# EAGLE design Binary_Sequencer_board2_controls (EAGLE 9.1.2)
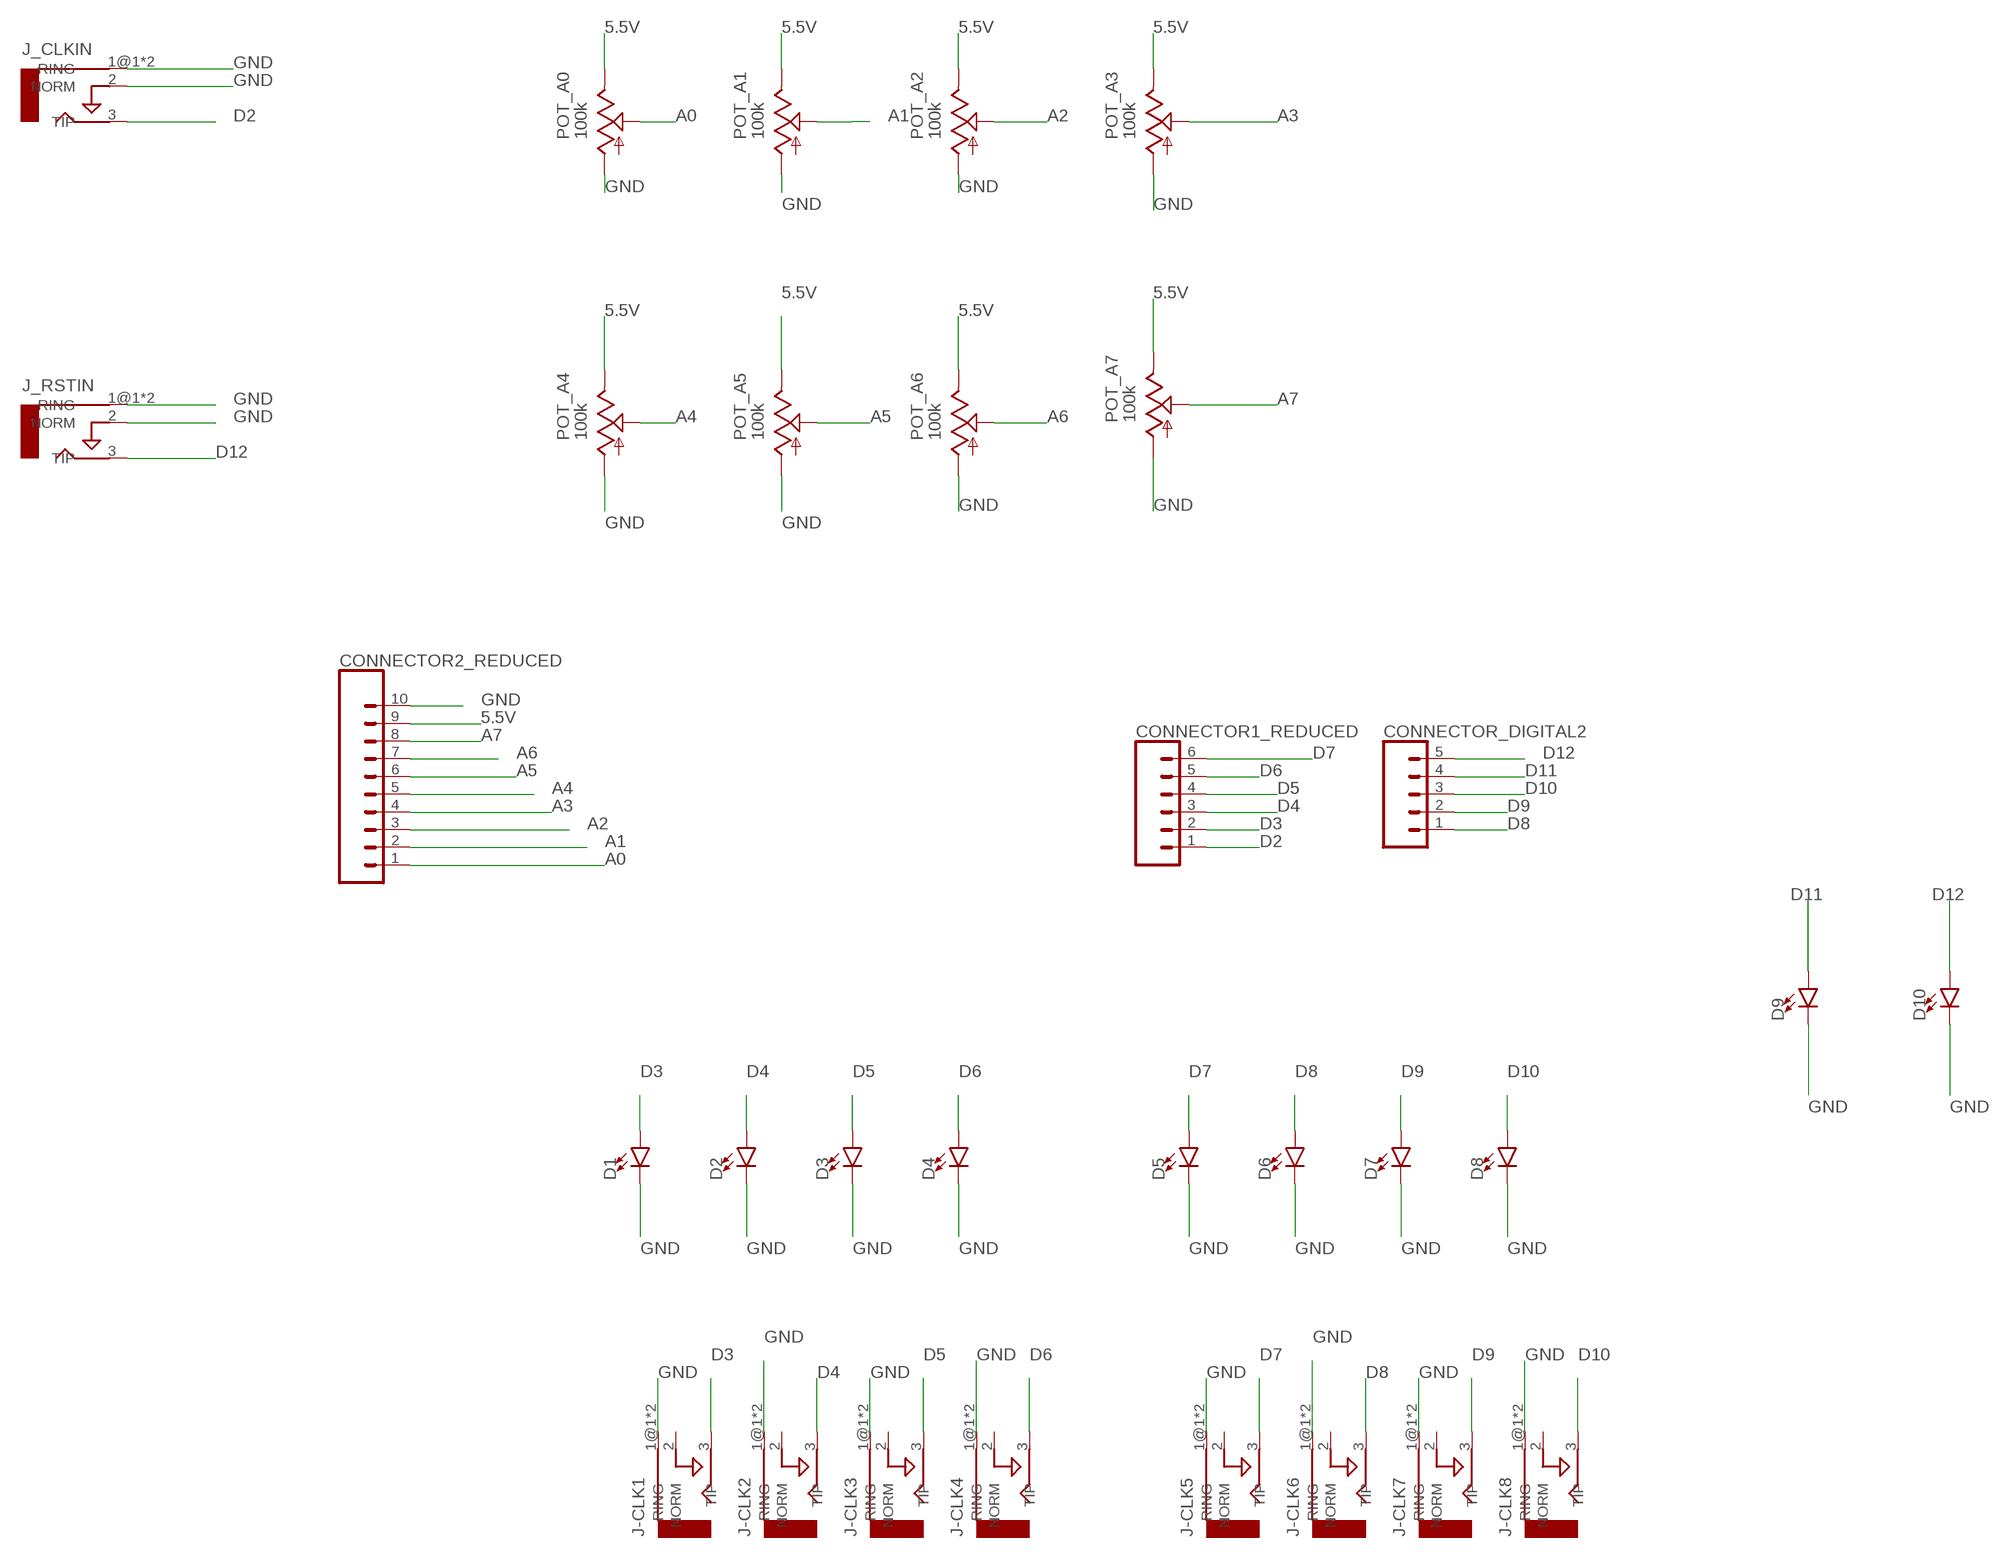
[diagram p0: schematic, sheet 1]

## Parts
CONNECTOR1_REDUCED  CONN_06LONGPADS  [1X06_LONGPADS]
CONNECTOR2_REDUCED  CONN_10_LONGPADS10_LONGPADS  [1X10_LONGPADS]
CONNECTOR_DIGITAL2  CONN_05PTH_LONGPADS  [1X05_LONGPADS]
D1  LED-3MM-NO_SILK  [LED_3MM-NS]
D2  LED-3MM-NO_SILK  [LED_3MM-NS]
D3  LED-3MM-NO_SILK  [LED_3MM-NS]
D4  LED-3MM-NO_SILK  [LED_3MM-NS]
D5  LED-3MM-NO_SILK  [LED_3MM-NS]
D6  LED-3MM-NO_SILK  [LED_3MM-NS]
D7  LED-3MM-NO_SILK  [LED_3MM-NS]
D8  LED-3MM-NO_SILK  [LED_3MM-NS]
D9  LED-3MM-NO_SILK  [LED_3MM-NS]
D10  LED-3MM-NO_SILK  [LED_3MM-NS]
J-CLK1  AUDIO-JACKERTHENVAR  [ERTHENVAR-JACK]
J-CLK2  AUDIO-JACKERTHENVAR  [ERTHENVAR-JACK]
J-CLK3  AUDIO-JACKERTHENVAR  [ERTHENVAR-JACK]
J-CLK4  AUDIO-JACKERTHENVAR  [ERTHENVAR-JACK]
J-CLK5  AUDIO-JACKERTHENVAR  [ERTHENVAR-JACK]
J-CLK6  AUDIO-JACKERTHENVAR  [ERTHENVAR-JACK]
J-CLK7  AUDIO-JACKERTHENVAR  [ERTHENVAR-JACK]
J-CLK8  AUDIO-JACKERTHENVAR  [ERTHENVAR-JACK]
J_CLKIN  AUDIO-JACKERTHENVAR  [ERTHENVAR-JACK]
J_RSTIN  AUDIO-JACKERTHENVAR  [ERTHENVAR-JACK]
POT_A0  100k  9MM_SNAP-IN_POT_  [9MM_SNAP-IN_POT]
POT_A1  100k  9MM_SNAP-IN_POT_  [9MM_SNAP-IN_POT]
POT_A2  100k  9MM_SNAP-IN_POT_  [9MM_SNAP-IN_POT]
POT_A3  100k  9MM_SNAP-IN_POT_  [9MM_SNAP-IN_POT]
POT_A4  100k  9MM_SNAP-IN_POT_  [9MM_SNAP-IN_POT]
POT_A5  100k  9MM_SNAP-IN_POT_  [9MM_SNAP-IN_POT]
POT_A6  100k  9MM_SNAP-IN_POT_  [9MM_SNAP-IN_POT]
POT_A7  100k  9MM_SNAP-IN_POT_  [9MM_SNAP-IN_POT]

## Nets
5.5V: CONNECTOR2_REDUCED.9 POT_A0.3(E) POT_A1.3(E) POT_A2.3(E) POT_A3.3(E) POT_A4.3(E) POT_A5.3(E) POT_A6.3(E) POT_A7.3(E)
A0: CONNECTOR2_REDUCED.1 POT_A0.2(S)
A1: CONNECTOR2_REDUCED.2 POT_A1.2(S)
A2: CONNECTOR2_REDUCED.3 POT_A2.2(S)
A3: CONNECTOR2_REDUCED.4 POT_A3.2(S)
A4: CONNECTOR2_REDUCED.5 POT_A4.2(S)
A5: CONNECTOR2_REDUCED.6 POT_A5.2(S)
A6: CONNECTOR2_REDUCED.7 POT_A6.2(S)
A7: CONNECTOR2_REDUCED.8 POT_A7.2(S)
D2: CONNECTOR1_REDUCED.1 J_CLKIN.3(TIP)
D3: CONNECTOR1_REDUCED.2 D1.A J-CLK1.3(TIP)
D4: CONNECTOR1_REDUCED.3 D2.A J-CLK2.3(TIP)
D5: CONNECTOR1_REDUCED.4 D3.A J-CLK3.3(TIP)
D6: CONNECTOR1_REDUCED.5 D4.A J-CLK4.3(TIP)
D7: CONNECTOR1_REDUCED.6 D5.A J-CLK5.3(TIP)
D8: CONNECTOR_DIGITAL2.1 D6.A J-CLK6.3(TIP)
D9: CONNECTOR_DIGITAL2.2 D7.A J-CLK7.3(TIP)
D10: CONNECTOR_DIGITAL2.3 D8.A J-CLK8.3(TIP)
D11: CONNECTOR_DIGITAL2.4 D9.A
D12: CONNECTOR_DIGITAL2.5 D10.A J_RSTIN.3(TIP)
GND: CONNECTOR2_REDUCED.10 D1.K(C) D2.K(C) D3.K(C) D4.K(C) D5.K(C) D6.K(C) D7.K(C) D8.K(C) D9.K(C) D10.K(C) J-CLK1.1@1(RING) J-CLK1.1@2(RING) J-CLK2.1@1(RING) J-CLK2.1@2(RING) J-CLK3.1@1(RING) J-CLK3.1@2(RING) J-CLK4.1@1(RING) J-CLK4.1@2(RING) J-CLK5.1@1(RING) J-CLK5.1@2(RING) J-CLK6.1@1(RING) J-CLK6.1@2(RING) J-CLK7.1@1(RING) J-CLK7.1@2(RING) J-CLK8.1@1(RING) J-CLK8.1@2(RING) J_CLKIN.1@1(RING) J_CLKIN.1@2(RING) J_CLKIN.2(NORM) J_RSTIN.1@1(RING) J_RSTIN.1@2(RING) J_RSTIN.2(NORM) POT_A0.1(A) POT_A1.1(A) POT_A2.1(A) POT_A3.1(A) POT_A4.1(A) POT_A5.1(A) POT_A6.1(A) POT_A7.1(A)
Unconnected: J-CLK1.2(NORM) J-CLK2.2(NORM) J-CLK3.2(NORM) J-CLK4.2(NORM) J-CLK5.2(NORM) J-CLK6.2(NORM) J-CLK7.2(NORM) J-CLK8.2(NORM)

## Library data of the parts
CONNECTOR1_REDUCED = SparkFun-Connectors:CONN_06: Multi connection point. Often used as Generic Header-pin footprint for 0.1 inch spaced/style header connections On any of the 0.1 inch spaced packages, you can populate with these: Break Away Headers - Straight <https://www.sparkfun.com/products/116> (PRT-00116) Break Away Male Headers - Right Angle <https://www.sparkfun.com/products/553> (PRT-00553) Female Headers <https://www.sparkfun.com/products/115> (PRT-00115) Break Away Headers - Machine Pin <https://www.sparkfun.com/products/117> (PRT-00117) Break Away Female Headers - Swiss Machine Pin <https://www.sparkfun.com/products/743> (PRT-00743) Arduino Stackable Header - 6 Pin <https://www.sparkfun.com/products/9280> (PRT-09280) For SCREWTERMINALS and SPRING TERMINALS visit here: Screw Terimnals on SparkFun.com <https://www.sparkfun.com/search/results?term=Screw+Terminals> (5mm/3.5mm/2.54mm spacing) This device is also useful as a general connection point to wire up your design to another part of your project. Our various solder wires solder well into these plated through hole pads. Hook-Up Wire - Assortment (Stranded, 22 AWG) <https://www.sparkfun.com/products/11375> (PRT-11375) Hook-Up Wire - Assortment (Solid Core, 22 AWG) <https://www.sparkfun.com/products/11367> (PRT-11367) View the entire wire category on our website here <https://www.sparkfun.com/categories/141>
CONNECTOR2_REDUCED = 10_Long_Pads:CONN_10_LONGPADS: Multi connection point. Often used as Generic Header-pin footprint for 0.1 inch spaced/style header connections On any of the 0.1 inch spaced packages, you can populate with these: Break Away Headers - Straight <https://www.sparkfun.com/products/116> (PRT-00116) Break Away Male Headers - Right Angle <https://www.sparkfun.com/products/553> (PRT-00553) Female Headers <https://www.sparkfun.com/products/115> (PRT-00115) Break Away Headers - Machine Pin <https://www.sparkfun.com/products/117> (PRT-00117) Break Away Female Headers - Swiss Machine Pin <https://www.sparkfun.com/products/743> (PRT-00743) For SCREWTERMINALS and SPRING TERMINALS visit here: Screw Terimnals on SparkFun.com <https://www.sparkfun.com/search/results?term=Screw+Terminals> (5mm/3.5mm/2.54mm spacing) This device is also useful as a general connection point to wire up your design to another part of your project. Our various solder wires solder well into these plated through hole pads. Hook-Up Wire - Assortment (Stranded, 22 AWG) <https://www.sparkfun.com/products/11375> (PRT-11375) Hook-Up Wire - Assortment (Solid Core, 22 AWG) <https://www.sparkfun.com/products/11367> (PRT-11367) View the entire wire category on our website here <https://www.sparkfun.com/categories/141>
CONNECTOR_DIGITAL2 = SparkFun-Connectors:CONN_05: Multi connection point. Often used as Generic Header-pin footprint for 0.1 inch spaced/style header connections On any of the 0.1 inch spaced packages, you can populate with these: Break Away Headers - Straight <https://www.sparkfun.com/products/116> (PRT-00116) Break Away Male Headers - Right Angle <https://www.sparkfun.com/products/553> (PRT-00553) Female Headers <https://www.sparkfun.com/products/115> (PRT-00115) Break Away Headers - Machine Pin <https://www.sparkfun.com/products/117> (PRT-00117) Break Away Female Headers - Swiss Machine Pin <https://www.sparkfun.com/products/743> (PRT-00743) For SCREWTERMINALS and SPRING TERMINALS visit here: Screw Terimnals on SparkFun.com <https://www.sparkfun.com/search/results?term=Screw+Terminals> (5mm/3.5mm/2.54mm spacing) This device is also useful as a general connection point to wire up your design to another part of your project. Our various solder wires solder well into these plated through hole pads. Hook-Up Wire - Assortment (Stranded, 22 AWG) <https://www.sparkfun.com/products/11375> (PRT-11375) Hook-Up Wire - Assortment (Solid Core, 22 AWG) <https://www.sparkfun.com/products/11367> (PRT-11367) View the entire wire category on our website here <https://www.sparkfun.com/categories/141> Special notes: Molex polarized connector foot print use with SKU : PRT-08231 with associated crimp pins and housings. 1MM SMD Version SKU: PRT-10208
D1-D10 = SparkFun-LED:LED: LED (Generic) Standard schematic elements and footprints for 5mm, 3mm, 1206, and 0603 sized LEDs. Generic LEDs with no color specified.
J-CLK1-J-CLK8 J_CLKIN J_RSTIN = erthenvar:AUDIO-JACK: Switching Mono 3.5mm Audio Jack from Erthenvar.
POT_A0 POT_A1-POT_A7 = MusicThingModular:9MM_SNAP-IN_POT: 9mm vertical snap-in pot, Alpha / Panasonic style

## Board
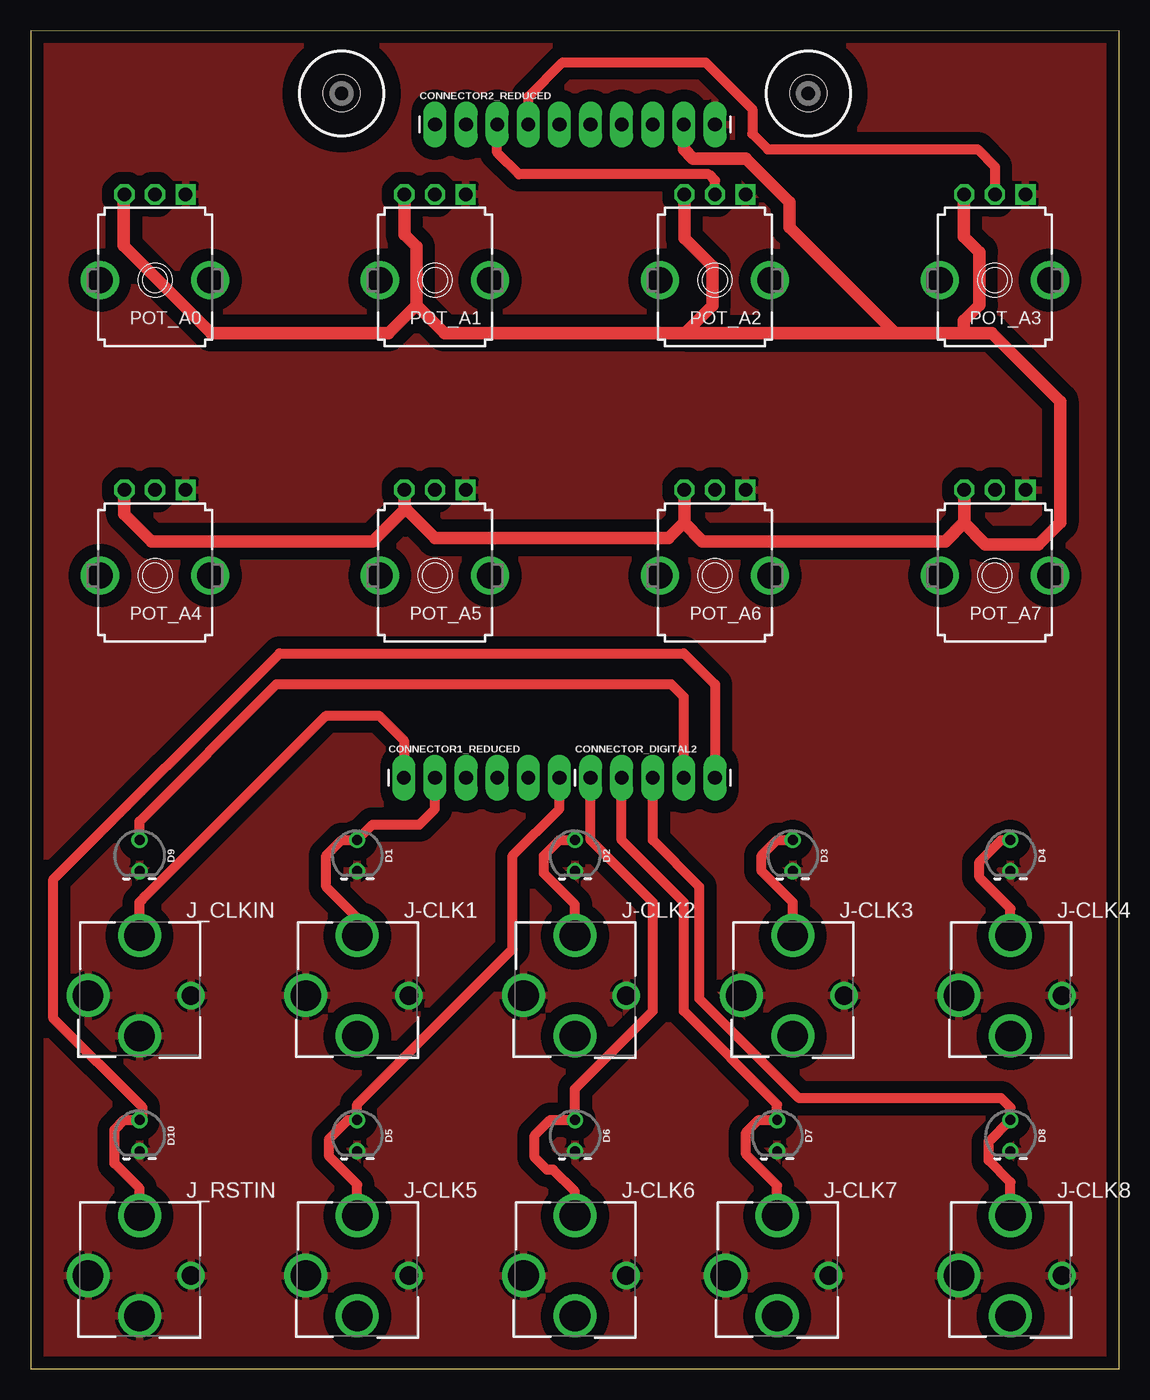
[diagram p1: board, top side]
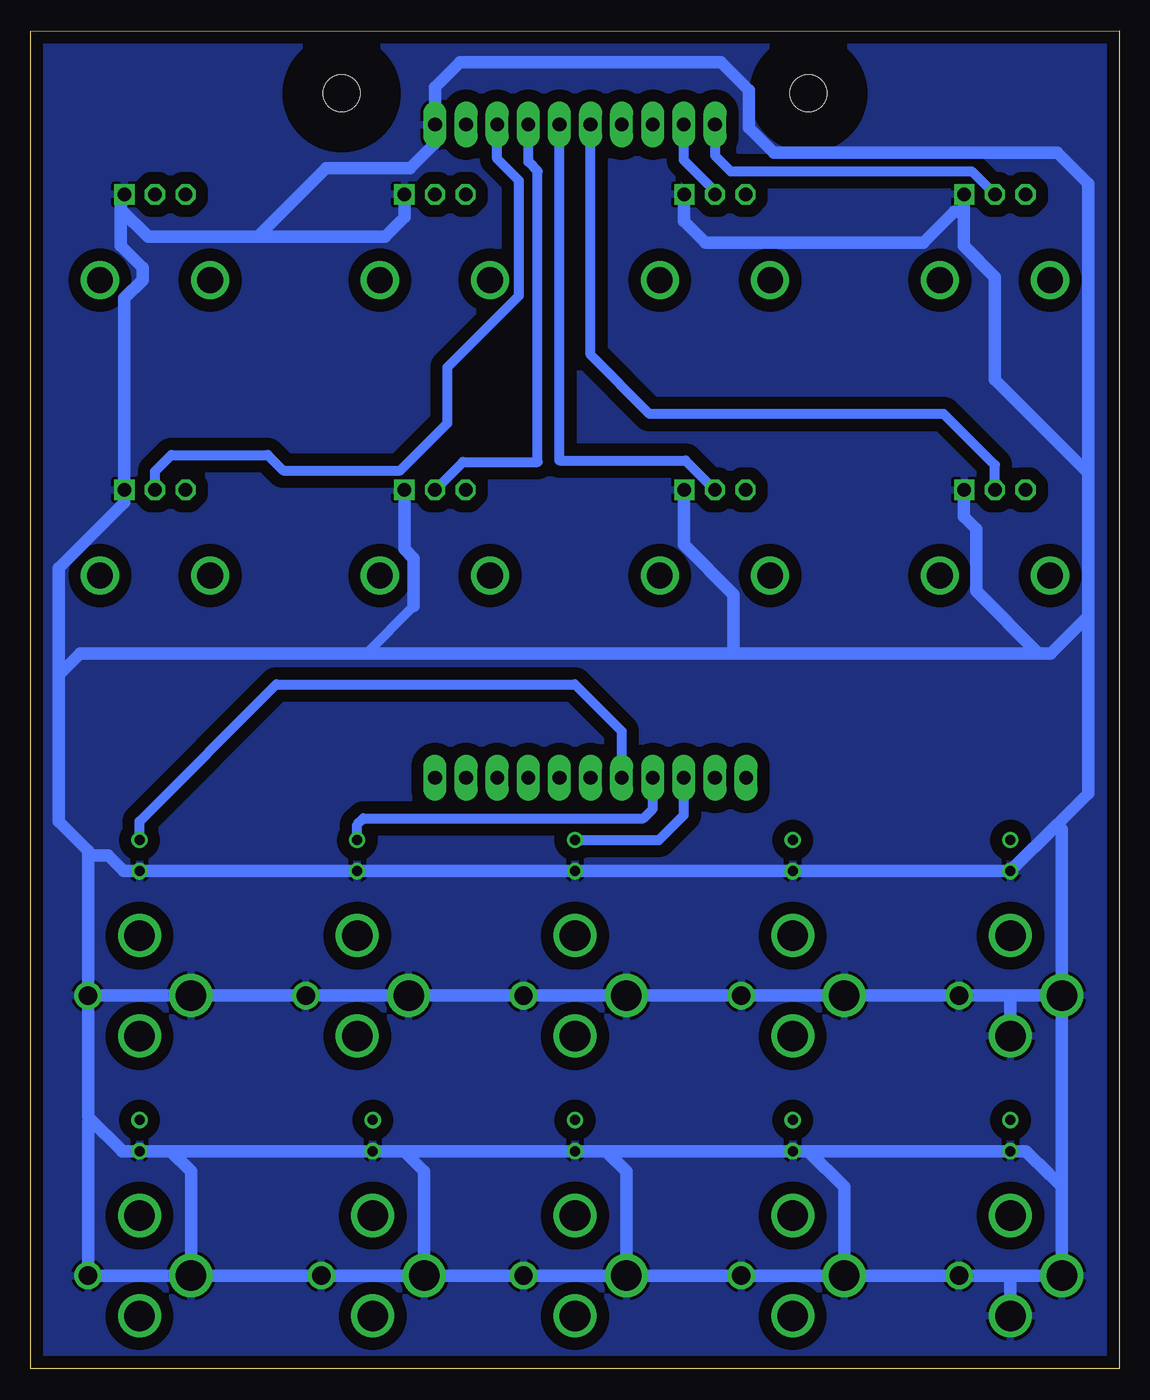
[diagram p2: board, bottom side, seen from below]

Size 88.9 x 109.27 mm. Coordinates in mm from the lower left corner, seen from the top.
Outline: 0,0 88.9,0 88.9,109.22 0,109.27 0,0
Copper layers (1*16): Top 0.035mm / dielectric 1.5mm / Bottom 0.035mm
Design rules "default": minimum track width 6mil, minimum drill 0.35mm, track to track 6mil, track to pad 6mil, pad to pad 6mil, via to via 6mil, smd to smd 6mil, copper to edge 40mil, drill to drill 6mil, minimum pad ring 10mil, minimum via ring 8mil, stop-mask expansion 4mil, vias tented up to drill 0mil, thermal gap 10mil

### Footprints (pad centres in the part's own frame; a part is rotated, then mirrored left to right if it is on the bottom)
1X06_LONGPADS = drill 1.118 pad 1.88 long: 1 0,0; 2 2.54,0; 3 5.08,0; 4 7.62,0; 5 10.16,0; 6 12.7,0
1X10_LONGPADS = drill 1.118 pad 1.88 long: 1 0,0; 2 2.54,0; 3 5.08,0; 4 7.62,0; 5 10.16,0; 6 12.7,0; 7 15.24,0; 8 17.78,0; 9 20.32,0; 10 22.86,0
1X05_LONGPADS = drill 1.118 pad 1.88 long: 1 0,0; 2 2.54,0; 3 5.08,0; 4 7.62,0; 5 10.16,0
LED_3MM-NS = drill 0.813: A -1.27,0; K 1.27,0
DRIL-3 = hole 3: 0,0
ERTHENVAR-JACK = drill 2.5: 1@1 -4.2,0; 2 0,-3.3; 3 0,4.9 | drill 1.5: 1@2 4.2,0
9MM_SNAP-IN_POT = drill 1.1 square: 1 -2.5,-7 | drill 1.1 octagon: 2 0,-7; 3 2.5,-7 | drill 2.1 pad 2.794: CHASSIS1 -4.5,0; CHASSIS2 4.5,0

### Placement (x,y rotation side)
CONNECTOR1_REDUCED  30.48,48.26 0 top
CONNECTOR2_REDUCED  33.02,101.6 0 top
CONNECTOR_DIGITAL2  45.72,48.26 0 top
D1  26.67,41.91 270 top
D2  44.45,41.91 270 top
D3  62.23,41.91 270 top
D4  80.01,41.91 270 top
D5  26.67,19.05 270 top
D6  44.45,19.05 270 top
D7  60.96,19.05 270 top
D8  80.01,19.05 270 top
D9  8.89,41.91 270 top
D10  8.89,19.05 270 top
H1  [DRIL-3]  25.4,104.14 0 top
H2  [DRIL-3]  63.5,104.14 0 top
J-CLK1  26.67,30.48 0 top
J-CLK2  44.45,30.48 0 top
J-CLK3  62.23,30.48 0 top
J-CLK4  80.01,30.48 0 top
J-CLK5  26.67,7.62 0 top
J-CLK6  44.45,7.62 0 top
J-CLK7  60.96,7.62 0 top
J-CLK8  80.01,7.62 0 top
J_CLKIN  8.89,30.48 0 top
J_RSTIN  8.89,7.62 0 top
POT_A0  10.16,88.9 180 top
POT_A1  33.02,88.9 180 top
POT_A2  55.88,88.9 180 top
POT_A3  78.74,88.9 180 top
POT_A4  10.16,64.77 180 top
POT_A5  33.02,64.77 180 top
POT_A6  55.88,64.77 180 top
POT_A7  78.74,64.77 180 top

### Tracks (layer width: path | path; a pad name or v marks a point on that pad's centre or on a via)
5.5V
  Top 1.016: 31.5,86.87 31.5,91.62 30.52,92.6 POT_A1.3 | 53.42,84.58 70.61,84.58 | 70.61,84.58 76.2,84.58 | 76.2,84.58 78.49,84.58 84.07,78.99 84.07,69.09 82.3,67.31 77.98,67.31 76.2,69.09 | 53.42,84.58 55.67,86.83 55.67,90.06 53.38,92.34 POT_A2.3 | POT_A0.3 7.62,95.86 7.62,91.69 14.73,84.58 29.21,84.58 31.5,86.87 | 30.52,70.14 POT_A5.3 | 30.52,70.14 27.94,67.56 9.91,67.56 7.66,69.81 POT_A4.3 | 76.2,69.09 76.24,69.13 POT_A7.3 | 76.2,69.09 74.68,67.56 54.86,67.56 53.34,69.09 | 53.34,69.09 53.38,69.13 POT_A6.3 | 53.34,69.09 52.07,67.82 33.02,67.82 30.69,70.14 30.52,70.14 | 31.5,86.87 33.78,84.58 53.42,84.58 | 76.2,84.58 76.2,85.6 77.47,86.87 77.47,91.19 76.2,92.46 76.2,95.86 POT_A3.3 | 70.61,84.58 61.98,93.22 61.98,95.25 58.42,98.81 54.1,98.81 53.34,99.57 CONNECTOR2_REDUCED.9
A0
  Bottom 0.813: POT_A0.2 12.05,97.79 31.75,97.79 33.02,99.06 CONNECTOR2_REDUCED.1
A1
  Bottom 0.813: CONNECTOR2_REDUCED.2 35.56,98.69 33.02,96.15 POT_A1.2
A2
  Top 0.813: POT_A2.2 55.88,97.03 55.37,97.54 39.88,97.54 38.1,99.31 CONNECTOR2_REDUCED.3
A3
  Top 0.813: POT_A3.2 78.74,98.16 77.33,99.57 60.2,99.57 58.93,100.84 58.93,102.87 55.12,106.68 43.43,106.68 40.64,103.89 CONNECTOR2_REDUCED.4
A4
  Bottom 0.813: POT_A4.2 10.16,73.8 14.34,77.98 38.35,77.98 43.18,82.8 CONNECTOR2_REDUCED.5
A5
  Bottom 0.813: CONNECTOR2_REDUCED.6 45.72,74.17 35.42,74.17 POT_A5.2
A6
  Bottom 0.813: CONNECTOR2_REDUCED.7 48.26,98.55 47.5,97.79 47.5,74.06 53.59,74.06 POT_A6.2
A7
  Bottom 0.813: CONNECTOR2_REDUCED.8 50.8,98.81 49.02,97.03 49.02,87.63 54.86,81.79 54.86,77.22 58.73,73.35 68.27,73.35 69.54,74.62 77.41,74.62 78.74,73.29 POT_A7.2
D2
  Top 0.813: 24.13,53.34 9.44,38.65 8.89,38.1 J_CLKIN.3 | 24.13,53.34 | 24.13,53.34 25.91,53.34 28.45,53.34 30.48,51.31 CONNECTOR1_REDUCED.1
D3
  Top 0.813: CONNECTOR1_REDUCED.2 33.02,45.72 31.75,44.45 27.94,44.45 D1.A 25.4,43.18 24.13,41.91 24.13,39.37 26.67,36.83 J-CLK1.3
D4
  Top 0.813: D2.A 43.18,43.18 41.91,41.91 41.91,40.46 44.45,37.92 J-CLK2.3
  Bottom 0.813: D2.A 41.91,43.18 37.59,43.18 35.56,45.21 CONNECTOR1_REDUCED.3
D5
  Top 0.813: J-CLK3.3 62.23,38.1 59.69,40.64 59.69,41.91 60.96,43.18 D3.A
  Bottom 0.813: CONNECTOR1_REDUCED.4 38.1,45.72 38.86,44.96 61.72,44.96 62.23,44.45 D3.A
D6
  Top 0.813: D4.A 79.25,43.18 77.47,41.4 77.47,40.13 80.01,37.59 J-CLK4.3
  Bottom 0.813: CONNECTOR1_REDUCED.5 40.64,52.07 44.45,55.88 68.83,55.88 80.01,44.7 D4.A
D7
  Top 0.813: J-CLK5.3 26.67,15.06 24.38,17.35 24.38,18.8 25.91,20.32 D5.A 26.67,21.59 39.37,34.29 39.37,41.91 43.18,45.72 CONNECTOR1_REDUCED.6
D8
  Top 0.813: J-CLK6.3 44.45,14.48 42.67,16.26 42.16,16.26 41.15,17.27 41.15,19.05 42.42,20.32 D6.A 44.45,22.86 50.8,29.21 50.8,38.1 45.72,43.18 CONNECTOR_DIGITAL2.1
D9
  Top 0.813: J-CLK7.3 60.96,14.99 58.42,17.53 58.42,19.3 59.44,20.32 D7.A 60.96,21.59 53.34,29.21 53.34,38.1 48.26,43.18 CONNECTOR_DIGITAL2.2
D10
  Top 0.813: J-CLK8.3 80.01,15.24 78.23,17.02 78.23,18.54 D8.A 80.01,21.34 79.25,22.1 77.47,22.1 62.74,22.1 54.61,30.23 54.61,39.37 50.8,43.18 CONNECTOR_DIGITAL2.3
D11
  Top 0.813: D9.A 8.89,44.7 20.07,55.88 52.32,55.88 53.34,54.86 CONNECTOR_DIGITAL2.4
D12
  Top 0.813: J_RSTIN.3 8.89,14.73 6.86,16.76 6.86,19.56 7.62,20.32 D10.A 9.14,20.57 9.14,21.34 1.86,28.61 1.86,39.97 20.32,58.42 53.34,58.42 55.88,55.88 CONNECTOR_DIGITAL2.5
GND
  Bottom 0.813: 61.47,58.42 57.62,62.27 | 81.24,70.75 POT_A7.1
  Bottom 1.016: 31.5,58.42 38.35,58.42 61.47,58.42 84.84,58.42 86.61,56.64 | 57.62,62.27 57.62,66.18 58.38,66.94 POT_A6.1 | 2.54,61.47 2.54,58.42 2.54,46.99 5.08,44.45 | 2.54,61.47 2.54,66.04 2.54,73.15 | 2.54,73.15 2.54,96.77 5.08,99.31 28.19,99.31 30.23,101.35 30.23,104.39 32.51,106.68 53.85,106.68 55.88,104.65 CONNECTOR2_REDUCED.10 55.88,100.08 57.91,98.04 64.77,98.04 70.36,92.46 | 81.24,70.75 86.61,65.38 86.61,58.42 86.61,56.64 | 5.08,44.45 D9.K D1.K D2.K D3.K D4.K 81.28,40.64 82.55,41.91 84.21,41.91 | 86.61,56.64 86.61,44.7 84.21,42.3 84.21,41.91 | 8.89,7.62 J_RSTIN.1@1 4.69,14.85 | 8.89,7.62 J_RSTIN.1@2 J-CLK5.1@1 | J_RSTIN.2 8.89,7.62 | J-CLK5.1@1 J-CLK5.1@2 J-CLK6.1@1 | J-CLK6.1@1 J-CLK6.1@2 J-CLK7.1@1 | J-CLK7.1@1 J-CLK7.1@2 J-CLK8.1@1 | J-CLK8.1@1 J-CLK8.1@2 84.21,20.18 84.02,20.38 | J-CLK3.1@1 J-CLK2.1@2 J-CLK2.1@1 J-CLK1.1@2 J-CLK1.1@1 J_CLKIN.1@2 8.89,30.48 | J-CLK3.1@1 58.42,30.48 J-CLK3.1@1 | J-CLK3.1@1 J-CLK3.1@2 J-CLK4.1@1 J-CLK4.1@2 | J-CLK5.1@1 22.47,14.85 25.4,17.78 D5.K | J-CLK6.1@1 40.25,16.12 41.91,17.78 D6.K | J-CLK7.1@1 56.76,16.12 58.42,17.78 D7.K | J-CLK8.1@1 75.81,16.12 77.47,17.78 D8.K | J_CLKIN.1@1 4.69,44.06 5.08,44.45 | J-CLK4.1@2 84.21,41.91 | D5.K D6.K | D6.K D7.K | D7.K D8.K | J_CLKIN.1@1 8.89,30.48 | J_CLKIN.2 8.89,30.48 | 4.69,14.85 5.71,15.88 7.62,17.78 D10.K D5.K | J-CLK4.1@2 84.21,21.34 84.21,20.57 84.02,20.38 | 4.69,14.85 J_CLKIN.1@1 | POT_A7.1 81.24,87.42 79.76,88.9 79.76,89.92 81.53,91.69 81.53,95.61 | POT_A2.1 58.38,94.02 59.94,92.46 70.36,92.46 | 2.54,73.15 10.16,80.77 10.16,89.15 12.7,91.69 12.7,94.49 | 12.7,94.49 12.7,95.86 POT_A0.1 | 12.7,94.49 13.46,94.49 16,91.95 33.78,91.95 35.56,93.73 35.56,95.86 POT_A1.1
  Bottom 1.016: 2.54,61.47 5.59,58.42 6.1,58.42 | 6.1,58.42 6.6,58.42 11.68,63.5 11.68,68.58 12.7,69.6 12.7,71.73 POT_A4.1 | 31.5,58.42 31.5,63.25 35.56,67.31 35.56,71.73 POT_A5.1 | D8.K 81.42,17.78 81.54,17.91 84.02,20.38 | 70.36,92.46 79.32,92.46 81.53,94.67 81.53,95.61 | 31.5,58.42 6.1,58.42 | 81.53,95.61 POT_A3.1
  pour Top (isolate 1): 0,0 0,109.22 88.39,109.22 88.9,109.73 88.9,0
  pour Bottom (isolate 1): 0,0 88.9,0 88.9,108.71 88.39,109.22 0,109.22

### Text on the board
tDocu: A0 | A7 | 5.5V | GND | D2 | D7